# Altium schematic sheet FPGA_Multiplexer.SchDoc
size A4
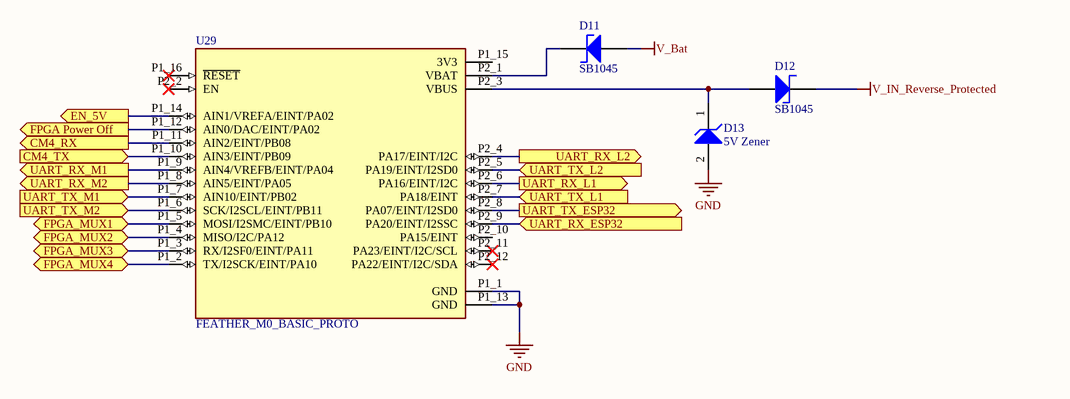
[diagram p0: FPGA_Multiplexer.SchDoc]

## Parts
D11  SB1045  [FP-95570-MFG]
D12  SB1045  [FP-95570-MFG]
D13  5V Zener  [ONSC-SMA-FL-2-403AA-01_V]
U29  FEATHER_M0_BASIC_PROTO  [MODULE_FEATHER_M0_BASIC_PROTO]

## Ports
CM4_RX (out), CM4_TX (in), EN_5V (out), FPGA Power Off (out), FPGA_MUX1 (bidir), FPGA_MUX2 (bidir), FPGA_MUX3 (bidir), FPGA_MUX4 (bidir), UART_RX_ESP32 (in), UART_RX_L1 (out), UART_RX_L2 (out), UART_RX_M1 (out), UART_RX_M2 (out), UART_TX_ESP32 (out), UART_TX_L1 (in), UART_TX_L2 (in), UART_TX_M1 (in), UART_TX_M2 (in)

## Nets
GND: D13.2(A) U29.P1_1(GND) U29.P1_13(GND)
V_Bat: D11.1(A)
V_IN_Reverse_Protected: D12.2(K)
CM4_RX: U29.P1_11(AIN2/EINT/PB08) ; port CM4_RX
CM4_TX: U29.P1_10(AIN3/EINT/PB09) ; port CM4_TX
EN_5V: U29.P1_14(AIN1/VREFA/EINT/PA02) ; port EN_5V
FPGA Power Off: U29.P1_12(AIN0/DAC/EINT/PA02) ; port FPGA Power Off
FPGA_MUX1: U29.P1_5(MOSI/I2SMC/EINT/PB10) ; port FPGA_MUX1
FPGA_MUX2: U29.P1_4(MISO/I2C/PA12) ; port FPGA_MUX2
FPGA_MUX3: U29.P1_3(RX/I2SF0/EINT/PA11) ; port FPGA_MUX3
FPGA_MUX4: U29.P1_2(TX/I2SCK/EINT/PA10) ; port FPGA_MUX4
UART_RX_ESP32: U29.P2_9(PA20/EINT/I2SSC) ; port UART_RX_ESP32
UART_RX_L1: U29.P2_6(PA16/EINT/I2C) ; port UART_RX_L1
UART_RX_L2: U29.P2_4(PA17/EINT/I2C) ; port UART_RX_L2
UART_RX_M1: U29.P1_9(AIN4/VREFB/EINT/PA04) ; port UART_RX_M1
UART_RX_M2: U29.P1_8(AIN5/EINT/PA05) ; port UART_RX_M2
UART_TX_ESP32: U29.P2_8(PA07/EINT/I2SD0) ; port UART_TX_ESP32
UART_TX_L1: U29.P2_7(PA18/EINT) ; port UART_TX_L1
UART_TX_L2: U29.P2_5(PA19/EINT/I2SD0) ; port UART_TX_L2
UART_TX_M1: U29.P1_7(AIN10/EINT/PB02) ; port UART_TX_M1
UART_TX_M2: U29.P1_6(SCK/I2SCL/EINT/PB11) ; port UART_TX_M2
NetD11_2: D11.2(K) U29.P2_1(VBAT)
NetD12_1: D12.1(A) D13.1(K) U29.P2_3(VBUS)

Not connected (* = marked no-connect by the designer): U29 P1_15(3V3) P1_16(~{RESET})* P2_2(EN)* P2_10(PA15/EINT) P2_11(PA23/EINT/I2C/SCL)* P2_12(PA22/EINT/I2C/SDA)*

## Library data of the parts
D11 D12 = SB1045: 10.0A SCHOTTKY BARRIER RECTIFIER
D13 = CMP-1061-00270-1: 600 W Peak Power Zener Transient Voltage Suppressor, Unidirectional, 2-Pin SMA-FL, Pb-Free, Tape and Reel; PartNumber: NS6A12AFT3G; Manufacturer: On Semiconductor; IR Max (uA): 0.5; PPK Max (W): 600; V(BR) Typ (V): 14; ComponentLink3URL: http://www.onsemi.com/pub_link/Collateral/403AA.PDF; ComponentLink2Description: Datasheet; PackageReference: SMA-FL-2-403AA-01; PackageDescription: 2-Pin Small Molded Package, Body 2.6 x 4.3 mm; ComponentLink3Description: Package Specification; RoHS: Pb-Free; ComponentLink1Description: Manufacturer URL; ComponentLink2URL: http://www.onsemi.com/pub_link/Collateral/NS6A5.0AF-D.PDF; Direction: Unidirectional; Mounting Technology: Surface Mount; DatasheetVersion: Rev. 0; PackageVersion: Rev. O, 03/2011; ComponentLink1URL: http://www.onsemi.com/; Packing: Tape and Reel
U29 = FEATHER_M0_BASIC_PROTO: ATSAMD21G18 Feather M0 Basic Proto SAM D ARMÂ® CortexÂ®-M0+ MCU 32-Bit Embedded Evaluation Board; MF: Adafruit Industries; Value: *; Package: Package; Price: None; MP: Feather M0 Basic Proto; Availability: Unavailable